# EAGLE design dev2 (EAGLE 5.10)
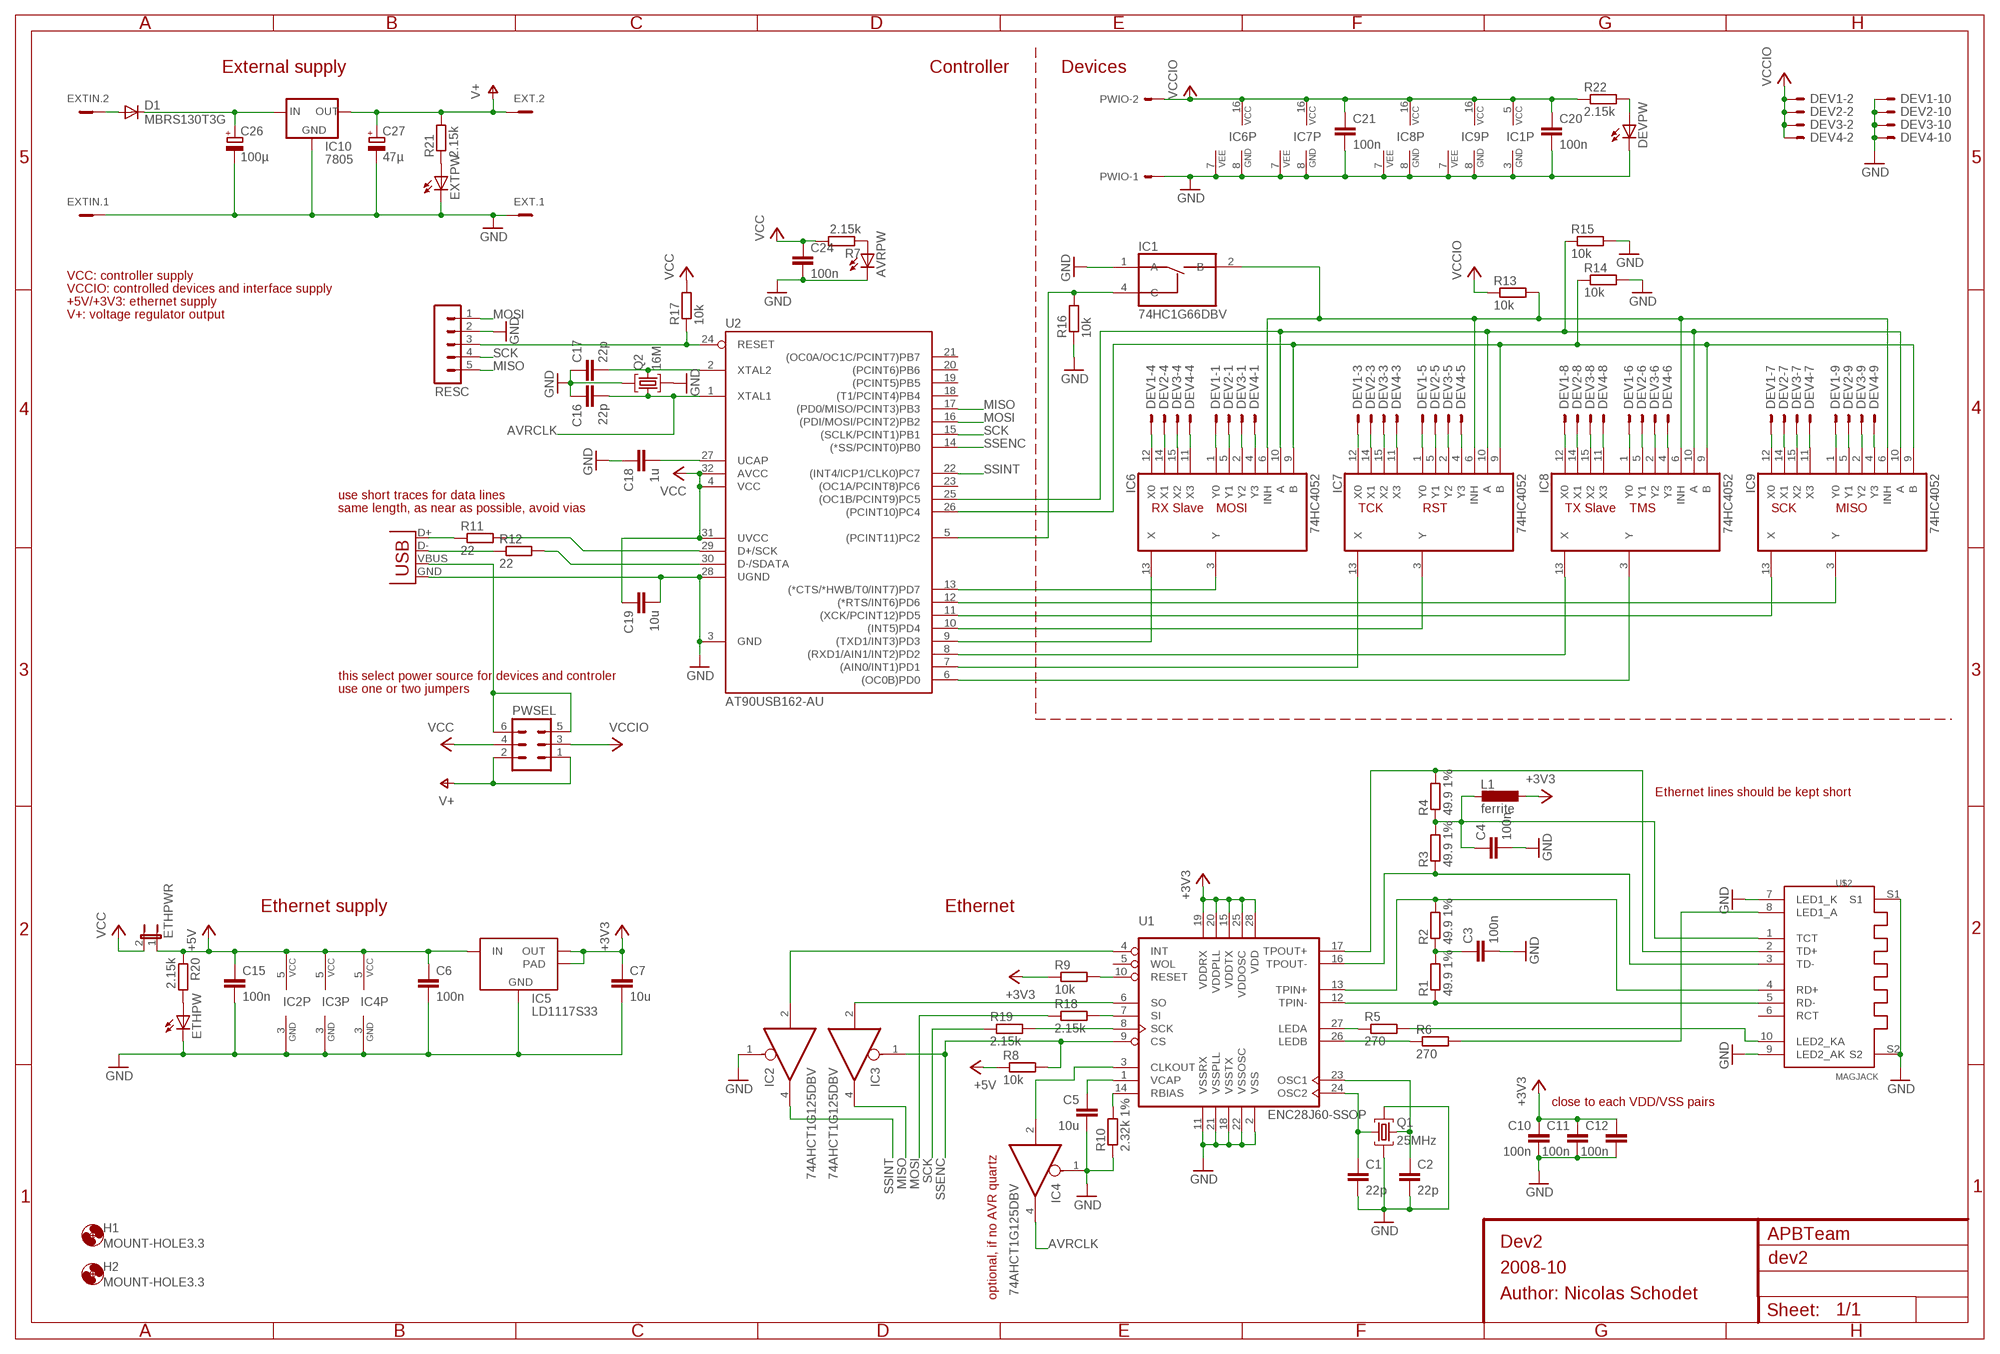
[diagram p0: schematic, sheet 1]

## Parts
AVRPW  LEDSMT1206  [1206]
C1  22p  C-EUC0603  [C0603]
C2  22p  C-EUC0603  [C0603]
C3  100n  C-EUC0603  [C0603]
C4  100n  C-EUC0603  [C0603]
C5  10u  C-EUC0603  [C0603]
C6  100n  C-EUC0603  [C0603]
C7  10u  C-EUC0603  [C0603]
C10  100n  C-EUC0603  [C0603]
C11  100n  C-EUC0603  [C0603]
C12  100n  C-EUC0603  [C0603]
C15  100n  C-EUC0603  [C0603]
C16  22p  C-EUC0603  [C0603]
C17  22p  C-EUC0603  [C0603]
C18  1u  C-EUC0603  [C0603]
C19  10u  C-EUC0603  [C0603]
C20  100n  C-EUC0603  [C0603]
C21  100n  C-EUC0603  [C0603]
C24  100n  C-EUC0603  [C0603]
C26  100µ  CPOL-EUD  [PANASONIC_D]
C27  47µ  CPOL-EUC  [PANASONIC_C]
D1  MBRS130T3G  DIODE-MELF-MLL41  [MELF-MLL41]
DEV1  ML10E  [ML10]
DEV2  ML10E  [ML10]
DEV3  ML10E  [ML10]
DEV4  ML10E  [ML10]
DEVPW  LEDSMT1206  [1206]
ETHPW  LEDSMT1206  [1206]
ETHPWR  JP1E  [JP1]
EXT  MC2  [MC2]
EXTIN  MC2  [MC2]
EXTPW  LEDSMT1206  [1206]
H1  MOUNT-HOLE3.3  [3,3]
H2  MOUNT-HOLE3.3  [3,3]
IC1  74HC1G66DBV  [SOT23-5]
IC2  74AHCT1G125DBV  [SOT23-5]
IC3  74AHCT1G125DBV  [SOT23-5]
IC4  74AHCT1G125DBV  [SOT23-5]
IC5  LD1117S33  1117-XX  [SOT223]
IC6  74HC4052  4052D  [SO16]
IC7  74HC4052  4052D  [SO16]
IC8  74HC4052  4052D  [SO16]
IC9  74HC4052  4052D  [SO16]
IC10  7805  78XXS  [78XXS]
L1  ferrite  L-EUL2012C  [L2012C]
PWIO  EC1X02  [EC1X02]
PWSEL  MA03-2  [MA03-2]
Q1  25MHz  Q2G  [ABMM1]
Q2  16M  Q2G  [ABMM1]
R1  49.9 1%  R-EU_R0603  [R0603]
R2  49.9 1%  R-EU_R0603  [R0603]
R3  49.9 1%  R-EU_R0603  [R0603]
R4  49.9 1%  R-EU_R0603  [R0603]
R5  270  R-EU_R0603  [R0603]
R6  270  R-EU_R0603  [R0603]
R7  2.15k  R-EU_R0603  [R0603]
R8  10k  R-EU_R0603  [R0603]
R9  10k  R-EU_R0603  [R0603]
R10  2.32k 1%  R-EU_R0603  [R0603]
R11  22  R-EU_R0603  [R0603]
R12  22  R-EU_R0603  [R0603]
R13  10k  R-EU_R0603  [R0603]
R14  10k  R-EU_R0603  [R0603]
R15  10k  R-EU_R0603  [R0603]
R16  10k  R-EU_R0603  [R0603]
R17  10k  R-EU_R0603  [R0603]
R18  2.15k  R-EU_R0603  [R0603]
R19  2.15k  R-EU_R0603  [R0603]
R20  2.15k  R-EU_R0603  [R0603]
R21  2.15k  R-EU_R0603  [R0603]
R22  2.15k  R-EU_R0603  [R0603]
RESC  MA05-1  [MA05-1]
U1  ENC28J60-SSOP  [SSOP28]
U2  AT90USB162-AU  [TQFP32-08]
U$2  MAGJACK  [08B0-1X1T-06-F]
USB  USB-B-H  [USB-B-H]

## Nets
+3V3: C7.1 C10.1 C11.1 C12.1 IC5.2(OUT) IC5.4(PAD) L1.1 R9.1 U1.15(VDDTX) U1.19(VDDRX) U1.20(VDDPLL) U1.25(VDDOSC) U1.28(VDD)
+5V: C6.1 C15.1 ETHPWR.1 IC2.5(VCC) IC3.5(VCC) IC4.5(VCC) IC5.3(IN) R8.1 R20.1
AVRCLK: C16.2 IC4.4(O) Q2.P$1 U2.1(XTAL1)
GND [supply]: AVRPW.C C1.2 C2.2 C3.2 C4.2 C5.2 C6.2 C7.2 C10.2 C11.2 C12.2 C15.2 C16.1 C17.1 C18.1 C19.2 C20.2 C21.2 C24.2 C26.- C27.- DEV1.10 DEV2.10 DEV3.10 DEV4.10 DEVPW.C ETHPW.C EXT.1 EXTIN.1 EXTPW.C IC1.1(A) IC1.3(GND) IC2.1(OE) IC2.3(GND) IC3.3(GND) IC4.1(OE) IC4.3(GND) IC5.1(GND) IC6.7(VEE) IC6.8(GND) IC7.7(VEE) IC7.8(GND) IC8.7(VEE) IC8.8(GND) IC9.7(VEE) IC9.8(GND) IC10.GND PWIO.1 Q1.P$2 Q1.P$4 Q2.P$2 Q2.P$4 R10.1 R14.2 R15.2 R16.1 RESC.2 U1.2(VSS) U1.11(VSSRX) U1.18(VSSTX) U1.21(VSSPLL) U1.22(VSSOSC) U2.3(GND) U2.28(UGND) U$2.7(LED1_K) U$2.9(LED2_AK) U$2.S1 U$2.S2 USB.GND
MISO: IC3.4(O) RESC.5 U2.17((PD0/MISO/PCINT3)PB3)
MOSI: R18.1 RESC.1 U2.16((PDI/MOSI/PCINT2)PB2)
MUXA: IC6.10(A) IC7.10(A) IC8.10(A) IC9.10(A) R15.1 U2.25((OC1B/PCINT9)PC5)
MUXB: IC6.9(B) IC7.9(B) IC8.9(B) IC9.9(B) R14.1 U2.26((PCINT10)PC4)
MUXEN: IC1.4(C) R16.2 U2.5((PCINT11)PC2)
MUXINH: IC1.2(B) IC6.6(INH) IC7.6(INH) IC8.6(INH) IC9.6(INH) R13.2
N$1: ETHPW.A R20.2
N$2: IC6.3(Y) U2.13((*CTS/*HWB/T0/INT7)PD7)
N$3: IC9.3(Y) U2.12((*RTS/INT6)PD6)
N$4: IC9.13(X) U2.11((XCK/PCINT12)PD5)
N$5: IC7.3(Y) U2.10((INT5)PD4)
N$6 [Ethernet]: C3.1 R1.2 R2.1
N$7: C1.1 Q1.P$1 U1.24(OSC2)
N$8: C2.1 Q1.P$3 U1.23(OSC1)
N$9: R5.2 U$2.10(LED2_KA)
N$10 [Ethernet]: R1.1 U1.12(TPIN-) U$2.5(RD-)
N$11 [Ethernet]: R2.2 U1.13(TPIN+) U$2.4(RD+)
N$12: R6.2 U$2.8(LED1_A)
N$13 [Ethernet]: C4.1 L1.2 R3.2 R4.1 U$2.1(TCT)
N$14: R5.1 U1.27(LEDA)
N$15 [Ethernet]: R3.1 U1.16(TPOUT-) U$2.3(TD-)
N$16 [Ethernet]: R4.2 U1.17(TPOUT+) U$2.2(TD+)
N$17: R6.1 U1.26(LEDB)
N$18: C5.1 U1.1(VCAP)
N$19: R9.2 U1.10(RESET)
N$20: R10.2 U1.14(RBIAS)
N$21: IC3.2(I) U1.6(SO)
N$22: IC2.2(I) U1.4(INT)
N$23: C17.2 Q2.P$3 U2.2(XTAL2)
N$24: D1.A EXTIN.2
N$25: IC4.2(I) U1.3(CLKOUT)
N$26: C26.+ D1.C IC10.IN
N$27: R12.2 U2.30(D-/SDATA)
N$28: R11.2 U2.29(D+/SCK)
N$30: R11.1 USB.D+
N$31: R12.1 USB.D-
N$32: R18.2 U1.7(SI)
N$33: IC6.13(X) U2.9((TXD1/INT3)PD3)
N$34: IC8.13(X) U2.8((RXD1/AIN1/INT2)PD2)
N$35: IC7.13(X) U2.7((AIN0/INT1)PD1)
N$36: IC8.3(Y) U2.6((OC0B)PD0)
N$37: DEV1.4 IC6.12(X0)
N$40: DEV2.4 IC6.14(X1)
N$41: DEV3.4 IC6.15(X2)
N$42: DEV4.4 IC6.11(X3)
N$43: DEV1.1 IC6.1(Y0)
N$44: DEV2.1 IC6.5(Y1)
N$45: DEV4.1 IC6.4(Y3)
N$46: DEV3.1 IC6.2(Y2)
N$47: DEV1.3 IC7.12(X0)
N$48: DEV2.3 IC7.14(X1)
N$49: DEV3.3 IC7.15(X2)
N$50: DEV4.3 IC7.11(X3)
N$51: DEV1.8 IC8.12(X0)
N$52: DEV1.5 IC7.1(Y0)
N$53: DEV2.5 IC7.5(Y1)
N$54: DEV3.5 IC7.2(Y2)
N$55: DEV4.5 IC7.4(Y3)
N$56: DEV2.8 IC8.14(X1)
N$57: DEV3.8 IC8.15(X2)
N$58: DEV4.8 IC8.11(X3)
N$59: DEV1.6 IC8.1(Y0)
N$60: DEV2.6 IC8.5(Y1)
N$61: DEV3.6 IC8.2(Y2)
N$62: DEV4.6 IC8.4(Y3)
N$63: DEV1.7 IC9.12(X0)
N$64: DEV2.7 IC9.14(X1)
N$65: DEV3.7 IC9.15(X2)
N$66: DEV4.7 IC9.11(X3)
N$67: DEV1.9 IC9.1(Y0)
N$68: DEV2.9 IC9.5(Y1)
N$69: DEV3.9 IC9.2(Y2)
N$70: DEV4.9 IC9.4(Y3)
N$75: EXTPW.A R21.1
N$76: R19.2 U1.8(SCK)
N$78: AVRPW.A R7.1
N$80: DEVPW.A R22.2
RESET: R17.1 RESC.3 U2.24(RESET)
SCK: R19.1 RESC.4 U2.15((SCLK/PCINT1)PB1)
SSENC: IC3.1(OE) R8.2 U1.9(CS) U2.14((*SS/PCINT0)PB0)
SSINT: IC2.4(O) U2.22((INT4/ICP1/CLK0)PC7)
UCAP: C18.2 U2.27(UCAP)
V+: C27.+ EXT.2 IC10.OUT PWSEL.1 PWSEL.2 R21.2
VBUS: PWSEL.5 PWSEL.6 USB.VBUS
VCC [supply]: C19.1 C24.1 ETHPWR.2 PWSEL.4 R7.2 R17.2 U2.4(VCC) U2.31(UVCC) U2.32(AVCC)
VCCIO [supply]: C20.1 C21.1 DEV1.2 DEV2.2 DEV3.2 DEV4.2 IC1.5(VCC) IC6.16(VCC) IC7.16(VCC) IC8.16(VCC) IC9.16(VCC) PWIO.2 PWSEL.3 R13.1 R22.1
Unconnected: U1.5(WOL) U2.18((T1/PCINT4)PB4) U2.19((PCINT5)PB5) U2.20((PCINT6)PB6) U2.21((OC0A/OC1C/PCINT7)PB7) U2.23((OC1A/PCINT8)PC6) U$2.6(RCT)

## Notes on the sheet
- External supply | Controller | Devices
- VCC: controller supply
- VCCIO: controlled devices and interface supply
- +5V/+3V3: ethernet supply
- V+: voltage regulator output
- use short traces for data lines
- same length, as near as possible, avoid vias | RX Slave | MOSI | TCK | RST | TX Slave | TMS | SCK | MISO
- this select power source for devices and controler
- use one or two jumpers
- Ethernet lines should be kept short
- Ethernet supply | Ethernet
- close to each VDD/VSS pairs
- APBTeam
- Dev2
- 2008-10
- optional, if no AVR quartz | Author: Nicolas Schodet

## Library data of the parts
AVRPW DEVPW ETHPW EXTPW = led:LED: LED OSRAM: - CHIPLED LG R971, LG N971, LY N971, LG Q971, LY Q971, LO R971, LY R971 LH N974, LH R974 LS Q976, LO Q976, LY Q976 LO Q996 - Hyper CHIPLED LW Q18S LB Q993, LB Q99A, LB R99A - SideLED LS A670, LO A670, LY A670, LG A670, LP A670 LB A673, LV A673, LT A673, LW A673 LH A674 LY A675 LS A676, LA A676, LO A676, LY A676, LW A676 LS A679, LY A679, LG A679 - Hyper Micro SIDELED® LS Y876, LA Y876, LO Y876, LY Y876 LT Y87S - SmartLED LW L88C, LW L88S LB L89C, LB L89S, LG L890 LS L89K, LO L89K, LY L89K LS L896, LA L896, LO L896, LY L896 - TOPLED LS T670, LO T670, LY T670, LG T670, LP T670 LSG T670, LSP T670, LSY T670, LOP T670, LYG T670 LG T671, LOG T671, LSG T671 LB T673, LV T673, LT T673, LW T673 LH T674 LS T676, LA T676, LO T676, LY T676, LB T676, LH T676, LSB T676, LW T676 LB T67C, LV T67C, LT T67C, LS T67K, LO T67K, LY T67K, LW E67C LS E67B, LA E67B, LO E67B, LY E67B, LB E67C, LV E67C, LT E67C LW T67C LS T679, LY T679, LG T679 LS T770, LO T770, LY T770, LG T770, LP T770 LB T773, LV T773, LT T773, LW T773 LH T774 LS E675, LA E675, LY E675, LS T675 LS T776, LA T776, LO T776, LY T776, LB T776 LHGB T686 LT T68C, LB T68C - Hyper Mini TOPLED® LB M676 - Mini TOPLED Santana® LG M470 LS M47K, LO M47K, LY M47K Source: http://www.osram.convergy.de/
C1-C7 C10-C12 C15-C21 C24 = rcl:C-EU: CAPACITOR, European symbol
C26 C27 = rcl:CPOL-EU: POLARIZED CAPACITOR, European symbol
D1 = diode:DIODE-: DIODE
DEV1-DEV4 = con-harting-ml:ML10?E: HARTING
ETHPWR = jumper:JP1E: JUMPER
EXT EXTIN = con-phoenix-381_l:MC2: Mini-Combicon 3.81mm horizontal 2-polig MC 1,5/2-G-3,81 Artikel-Nr. 1803277
H1 H2 = holes:MOUNT-HOLE: MOUNTING HOLE with drill center marker
IC1 = apbteam_logic:*1G66: Single bilateral ANALOG SWITCH
IC2-IC4 = 74xx-little-us:74*1G125: Single Bus Buffer Gate with 3-State Output
IC5 = apbteam_v-reg:1117-XX: Low-dropout voltage regulator
IC6-IC9 = 40xx:4052: Dual 4-channel ANALOG MULTIPLEXER
IC10 = v-reg:78XXS: VOLTAGE REGULATOR
L1 = rcl:L-EU: INDUCTOR, European symbol
PWIO = apbteam_con-amp-he14:E?1X02: Male header simple row, 2 positions
PWSEL = con-lstb:MA03-2: PIN HEADER
Q1 Q2 = apbteam_cristals:Q2G: Crystal with two ground connectors
R1-R22 = rcl:R-EU_: RESISTOR, European symbol
RESC = con-lstb:MA05-1: PIN HEADER
U1 = microchip-enc28j60:ENC28J60-*: Microchip 10Mbit Eth. contoller with SPI interface
U2 = at90usb:AT90USB162-*
U$2 = magjack:MAGJACK: Magjack RJ45: 08B0-1X1T-06-F mcgregor@blackmesaeast.com.pl
USB = con-usb:USB: USB Connectors

## Net classes
1 supply: width 0.254 mm
2 Ethernet: width 0.381 mm

## Board
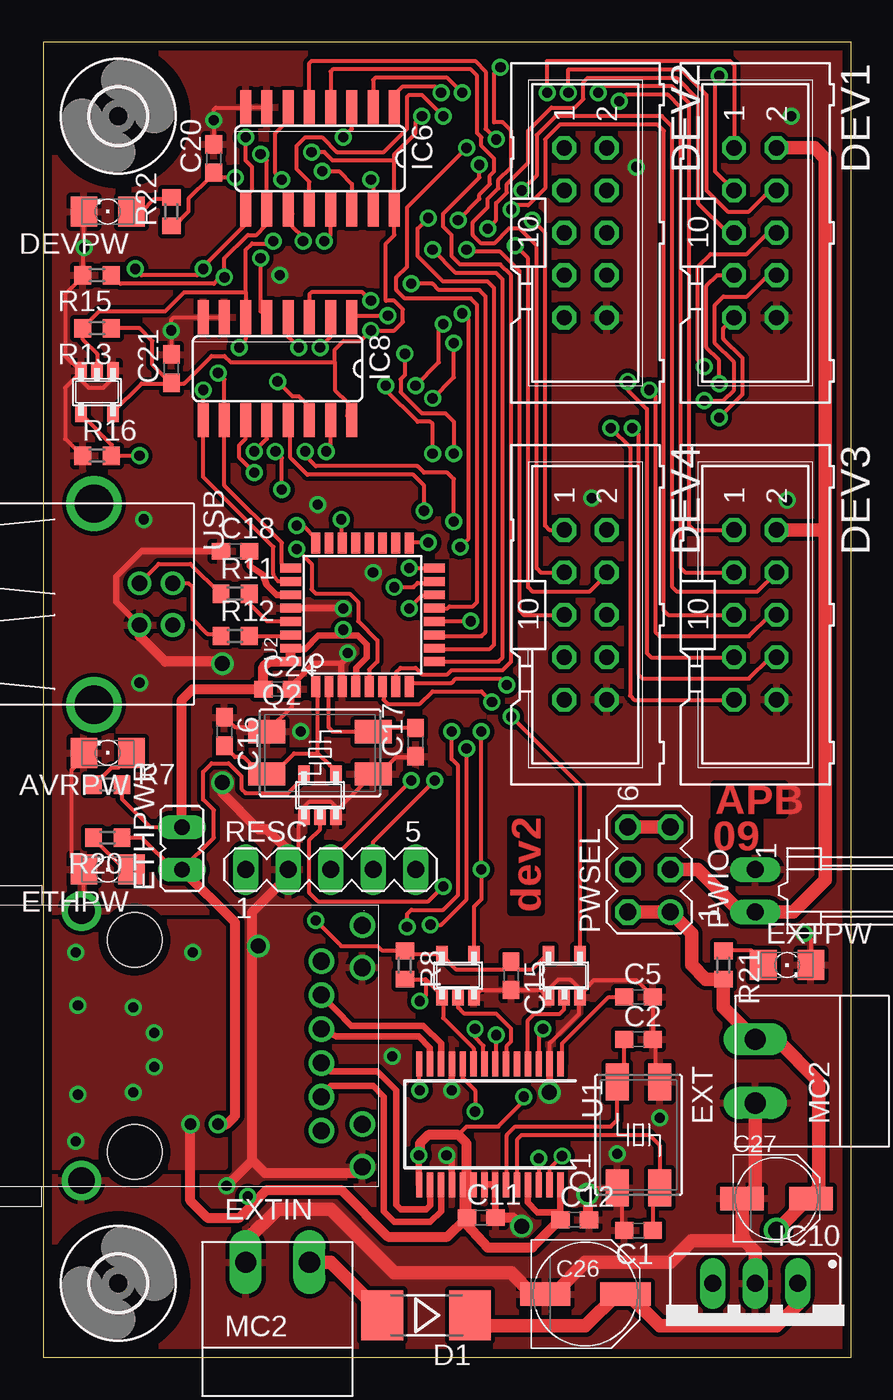
[diagram p1: board, top side]
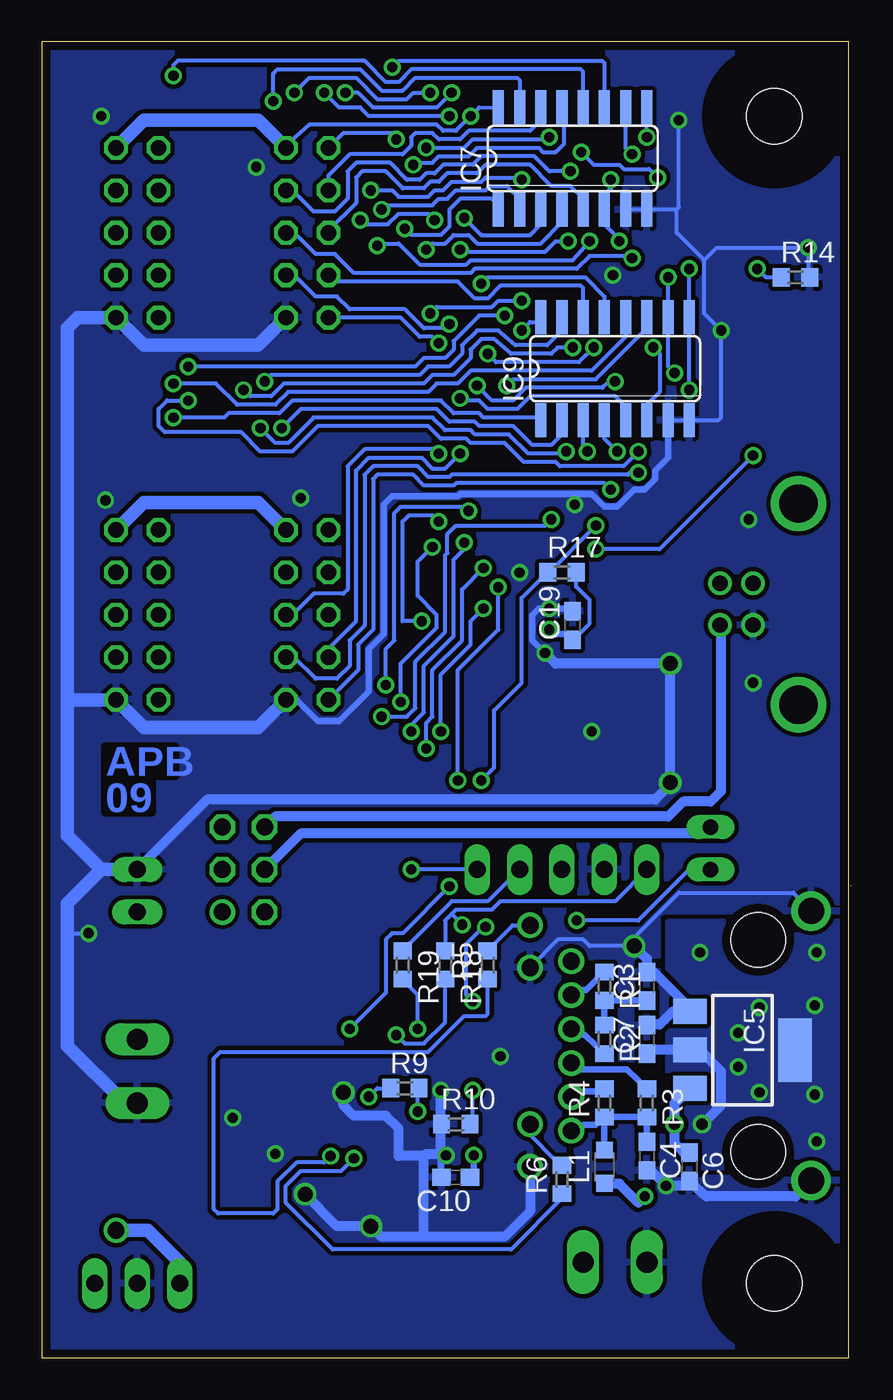
[diagram p2: board, bottom side, seen from below]

Size 48.26 x 78.74 mm. Coordinates in mm from the lower left corner, seen from the top.
Outline: 0,0 0,78.74 48.26,78.74 48.26,0 0,0
Copper layers (1*16): Top 0.035mm / dielectric 1.5mm / Bottom 0.035mm
Design rules "10mils": minimum track width 10mil, minimum drill 24mil, track to track 10mil, track to pad 10mil, pad to pad 10mil, via to via 10mil, smd to smd 10mil, copper to edge 20mil, drill to drill 10mil, minimum pad ring 10mil, minimum via ring 8mil, stop-mask expansion 0mil, vias tented up to drill 0mil, thermal gap 10mil
bKeepout: area 12.3,34.3 to 20.7,40.1; area 6.1,42.7 to 14.7,47.6

### Footprints (pad centres in the part's own frame; a part is rotated, then mirrored left to right if it is on the bottom)
1206 = smd 1.6 x 1.803: A -1.422,0; C 1.422,0
C0603 = smd 1.1 x 1: 1 -0.85,0; 2 0.85,0
PANASONIC_D = smd 3 x 1.4: + 2.4,0; - -2.4,0
PANASONIC_C = smd 2.6 x 1.4: + 2.05,0; - -2.05,0
MELF-MLL41 = smd 2.5 x 3: A 2.625,0; C -2.625,0
ML10 = drill 0.914 octagon: 1 -5.08,-1.27; 2 -5.08,1.27; 3 -2.54,-1.27; 4 -2.54,1.27; 5 0,-1.27; 6 0,1.27; 7 2.54,-1.27; 8 2.54,1.27; 9 5.08,-1.27; 10 5.08,1.27
JP1 = drill 0.914 long: 1 0,-1.27; 2 0,1.27
MC2 = drill 1.27 long: 1 -1.905,0; 2 1.905,0
3,3 = hole 3.3: 0,0
SOT23-5 = smd 0.69 x 0.99: 1 -0.95,-1.29; 2 0,-1.29; 3 0.95,-1.29; 4 0.95,1.3; 5 -0.95,1.3
SOT223 = smd 1.5 x 2: 1 -2.3,-3.15; 2 0,-3.15; 3 2.3,-3.15 | smd 3.8 x 2: 4 0,3.15
SO16 = smd 0.66 x 2.032: 1 -4.445,-3.073; 2 -3.175,-3.073; 3 -1.905,-3.073; 4 -0.635,-3.073; 5 0.635,-3.073; 6 1.905,-3.073; 7 3.175,-3.073; 8 4.445,-3.073; 9 4.445,3.073; 10 3.175,3.073; 11 1.905,3.073; 12 0.635,3.073; 13 -0.635,3.073; 14 -1.905,3.073; 15 -3.175,3.073; 16 -4.445,3.073
78XXS = drill 1.016 long: GND 0,-2.54; IN -2.54,-2.54; OUT 2.54,-2.54
L2012C = smd 1 x 1: 1 -1,0; 2 1,0
EC1X02 = drill 1 long: 1 -1.27,0; 2 1.27,0
MA03-2 = drill 1.016 round: 1 -2.54,-1.27 | drill 1.016 octagon: 2 -2.54,1.27; 3 0,-1.27; 4 0,1.27; 5 2.54,-1.27; 6 2.54,1.27
ABMM1 = smd 2.21 x 1.397: P$1 -3.175,-1.27; P$2 -3.175,1.27; P$3 3.175,1.27; P$4 3.175,-1.27
R0603 = smd 1 x 1.1: 1 -0.85,0; 2 0.85,0
MA05-1 = drill 1.016 long: 1 -5.08,0; 2 -2.54,0; 3 0,0; 4 2.54,0; 5 5.08,0
SSOP28 = smd 0.381 x 1.499: 1 -4.225,-3.625; 2 -3.575,-3.625; 3 -2.925,-3.625; 4 -2.275,-3.625; 5 -1.625,-3.625; 6 -0.975,-3.625; 7 -0.325,-3.625; 8 0.325,-3.625; 9 0.975,-3.625; 10 1.625,-3.625; 11 2.275,-3.625; 12 2.925,-3.625; 13 3.575,-3.625; 14 4.225,-3.625; 15 4.225,3.625; 16 3.575,3.625; 17 2.925,3.625; 18 2.275,3.625; 19 1.625,3.625; 20 0.975,3.625; 21 0.325,3.625; 22 -0.325,3.625; 23 -0.975,3.625; 24 -1.625,3.625; 25 -2.275,3.625; 26 -2.925,3.625; 27 -3.575,3.625; 28 -4.225,3.625
TQFP32-08 = smd 1.27 x 0.533: 1 -4.293,2.8; 2 -4.293,2; 3 -4.293,1.2; 4 -4.293,0.4; 5 -4.293,-0.4; 6 -4.293,-1.2; 7 -4.293,-2; 8 -4.293,-2.8; 17 4.293,-2.8; 18 4.293,-2; 19 4.293,-1.2; 20 4.293,-0.4; 21 4.293,0.4; 22 4.293,1.2; 23 4.293,2; 24 4.293,2.8 | smd 0.533 x 1.27: 9 -2.8,-4.293; 10 -2,-4.293; 11 -1.2,-4.293; 12 -0.4,-4.293; 13 0.4,-4.293; 14 1.2,-4.293; 15 2,-4.293; 16 2.8,-4.293; 25 2.8,4.293; 26 2,4.293; 27 1.2,4.293; 28 0.4,4.293; 29 -0.4,4.293; 30 -1.2,4.293; 31 -2,4.293; 32 -2.8,4.293
08B0-1X1T-06-F = drill 1.02 round: 1 2.15,2.46; 2 4.18,2.46; 3 6.21,2.46; 4 8.24,2.46; 5 10.27,2.46; 6 12.3,2.46; 7 0,0; 8 2.54,0; 9 11.91,0; 10 14.45,0 | drill 1.57 round: S1 -0.83,16.808; S2 15.3,16.809 | hole 3.25: 0.88,13.63; 13.58,13.63
USB-B-H = drill 0.914 round: D+ 0,1.25; D- 1.981,1.25; GND 0,-1.25; VBUS 1.981,-1.25 | drill 2.286 round: P$1 -2.718,-6.02; P$2 -2.718,6.02

### Placement (x,y rotation side)
AVRPW  3.81,36.2 180 top
C1  35.56,7.62 180 top
C2  35.56,19.05 0 top
C3  12.06,22.23 90 bottom
C4  12.06,12.06 270 bottom
C5  35.56,21.59 0 top
C6  9.53,11.43 270 bottom
C7  12.06,19.05 90 bottom
C10  23.5,10.79 180 bottom
C11  26.16,8.38 0 top
C12  31.75,8.26 0 top
C15  27.94,22.86 270 top
C16  10.79,37.47 270 top
C17  22.23,36.83 90 top
C18  11.43,48.26 0 top
C19  16.51,43.81 90 bottom
C20  10.16,71.75 90 top
C21  7.62,59.18 90 top
C24  13.97,40.01 0 top
C26  32.38,3.81 0 top
C27  43.81,9.53 0 top
D1  22.86,2.54 180 top
DEV1  42.55,67.31 270 top
DEV2  32.38,67.31 270 top
DEV3  42.55,44.45 270 top
DEV4  32.38,44.45 270 top
DEVPW  3.81,68.58 180 top
ETHPW  3.81,29.21 180 top
ETHPWR  8.26,30.48 0 top
EXT  42.55,17.14 90 top
EXTIN  13.97,5.71 0 top
EXTPW  44.45,23.5 0 top
H1  4.45,74.3 0 top
H2  4.45,4.45 0 top
IC1  3.17,57.78 180 top
IC2  31.11,22.86 0 top
IC3  24.77,22.86 0 top
IC4  16.51,33.66 0 top
IC5  6.35,18.41 270 bottom
IC6  16.51,71.75 180 top
IC7  16.51,71.75 0 bottom
IC8  13.97,59.18 180 top
IC9  13.97,59.18 0 bottom
IC10  42.55,1.91 180 top
L1  14.61,11.43 90 bottom
PWIO  42.55,27.94 270 top
PWSEL  36.2,29.21 90 top
Q1  35.56,13.34 90 top
Q2  16.51,36.2 0 top
R1  14.61,22.23 270 bottom
R2  14.61,19.05 270 bottom
R3  12.06,15.24 270 bottom
R4  14.61,15.24 90 bottom
R5  21.59,23.5 90 bottom
R6  17.14,10.67 90 bottom
R7  3.81,34.29 0 top
R8  21.59,23.5 270 top
R9  26.54,16.13 0 bottom
R10  23.5,13.97 0 bottom
R11  11.43,45.72 0 top
R12  11.43,43.18 0 top
R13  3.17,61.59 180 top
R14  3.17,64.64 0 bottom
R15  3.17,64.77 180 top
R16  3.17,53.98 0 top
R17  17.14,46.99 0 bottom
R18  24.13,23.5 270 bottom
R19  26.67,23.5 270 bottom
R20  3.81,31.11 180 top
R21  40.64,23.5 270 top
R22  7.62,68.58 90 top
RESC  17.14,29.21 0 top
U1  26.67,13.97 180 top
U2  19.05,44.45 90 top
U$2  19.05,11.43 90 top
USB  5.71,45.09 0 top

### Tracks (layer width: path | path; a pad name or v marks a point on that pad's centre or on a via)
+3V3  (via drill 0.61, 0.7)
  Top 0.254: v28.7,15.62 28.7,15.37 27.18,13.84 25.27,13.84 24.77,13.34
  Top 0.381: U1.28 30.89,10.34 30.89,8.27 C12.1 30.86,8.29 30.86,8.71 29.52,8.71 28.93,9.3 28.93,10.33 U1.25 | 25.04,10.36 U1.19 25.05,10.34 | 25.04,8.65 C11.1 25.15,8.38 25.05,8.48 25.05,10.34 | 25.69,10.34 U1.20 25.59,10.35 25.53,10.29 25.48,10.34 25.05,10.34 | U1.15 22.43,10.36 v22.43,12.12 22.43,12.14 22.48,12.19
  Top 0.61: v8.76,13.97 8.76,9.4 9.78,8.38 11.68,8.38 12.57,9.27 | 25.27,8.38 C11.1 25.31,7.96 26.54,6.6 29.21,6.6 30.86,8.26 C12.1 | 25.27,8.38 24.13,7.24 20.57,7.24 17.78,10.03 13.34,10.03 12.57,9.27 | 25.27,8.38 25.27,12.83 24.77,13.34 22.99,13.34 22.48,12.83 22.48,12.19 22.48,12.06 | 12.57,9.27 v12.19,9.65
  Bottom 0.254: v28.7,15.62 28.19,16.13 R9.1
  Bottom 0.381: C10.1 22.43,11.01 v22.43,12.12
  Bottom 0.61: v8.76,13.97 7.62,15.11 7.62,17.14 8.89,18.41 IC5.2 11.68,18.41 11.94,18.16 11.98,18.2 C7.1 | v12.19,9.65 12.57,9.27 13.72,10.41 14.61,10.41 L1.1
  other vias: 1.91,24.26 2.03,21.08 8.89,24.26 2.03,15.75 1.91,12.95 5.33,20.95 6.6,19.43 6.6,17.4 5.33,15.88
  pour Bottom (isolate 0.254, no thermals): 0,26.04 10.79,26.04 10.79,11.43 0,11.43
  pour Top (isolate 0.254, no thermals): 0,26.04 10.79,26.04 10.79,11.43 0,11.43
+5V  (via drill 0.61, 0.7)
  Top 0.254: IC4.5 15.56,34.74 14.61,33.78 12.06,33.78 11.81,34.04 11.81,34.8 11.05,35.56 10.03,35.56 9.53,35.05 9.53,33.4 10.16,32.77 10.16,31.11 ETHPWR.1 7.75,29.21 5.84,31.11 R20.1 | 21.59,24.38 R8.1 | 21.59,24.38 21.81,24.16 IC3.5 23.82,24.06 24.64,23.24 27.56,23.24 27.94,23.62 | IC2.5 30.13,24.16 29.21,23.24 28.32,23.24 27.94,23.62 | 27.94,23.62 C15.1 | 21.59,24.38 20.19,24.38 19.94,24.64 17.78,24.64 v16.26,26.16
  Top 0.61: ETHPWR.1 11.43,26.04 11.43,14.48 10.92,13.97 v10.41,13.97
  Bottom 0.254: v16.26,26.16 12.57,26.16 9.53,29.21 ETHPWR.1
  Bottom 0.61: IC5.3 9.5,16.03 9.53,16 10.41,15.24 v10.41,13.97 10.41,12.83 9.87,12.28 C6.1
AVRCLK
  Top 0.254: 16.38,36.17 16.38,39.55 U2.1 | 16.38,36.17 17.12,35.43 IC4.4 | 16.38,36.17 14.96,36.17 13.84,35.05 13.59,35.05 13.46,34.92 Q2.P$1 12.95,34.92 11.94,35.94 11.43,35.94 C16.2
GND  (via drill 0.61, 0.9)
  Top 0.254: C1.2 34.54,7.62 34.54,10.16 Q1.P$2 32.89,10.16 v32.51,9.78 | Q1.P$4 36.58,16.51 36.58,18.92 36.45,19.05 C2.2 36.41,21.55 36.45,21.59 C5.2 36.41,21.63 35.43,22.61 32.89,22.61 32.06,21.65 | 45.85,23.5 EXTPW.C 45.87,25.04 v45.47,25.4 | 12.06,74.8 IC6.8 | IC6.7 12.09,74.83 12.06,74.8 | 12.06,74.8 10.29,74.8 10.16,74.68 v10.16,74.04 C20.2 | IC8.7 9.55,62.26 9.53,62.23 IC8.8 7.77,62.26 7.62,62.1 v7.62,61.47 C21.2 7.62,59.94 | 2.39,64.87 2.29,64.77 R15.2 2.33,64.68 | 2.33,64.68 1.27,63.63 1.27,59.94 2.16,59.05 2.18,59.08 IC1.3 | IC1.3 2.23,58.48 2.67,58.04 3.56,58.04 4.06,58.55 4.06,59.05 4.08,59.08 IC1.1 | IC1.3 2.23,58.99 1.27,58.04 1.27,54.99 2.29,53.98 R16.1 | C24.2 14.82,38.95 Q2.P$2 13.08,37.72 11.43,37.72 C16.1 | C17.1 22.14,35.98 22.1,35.94 21.08,35.94 20.07,34.92 Q2.P$4 17.46,32.7 IC4.3 17.42,32.37 17.4,32.38 17.4,33.02 17.14,33.27 15.88,33.27 15.56,32.96 IC4.1 15.24,31.88 15.24,30.35 RESC.2 | 32.06,21.65 32.06,22.04 31.5,22.61 30.73,22.61 30.16,22.04 IC2.1 30.12,21.57 29.72,21.97 27.94,21.97 | 32.06,21.65 IC2.3 32.02,21.57 32,21.59 32,20.57 30.25,18.82 U1.2 | 27.94,21.97 C15.2 | IC3.3 26.12,21.97 27.94,21.97 | AVRPW.C 2.39,35.92 1.65,35.18 1.65,29.97 2.41,29.21 ETHPW.C 2.39,26.9 2.24,26.75 U$2.S2 | DEVPW.C 2.39,66.45 v2.41,66.42 2.33,66.33 2.33,64.68
  Top 0.305: C24.2 14.82,40.22 16.13,41.53 17.78,41.53 | 17.85,40.19 U2.3
  Top 0.381: U1.18 24.39,11.8 v24.08,12.12 | C11.2 27,8.39 U1.22 26.98,10.36 26.34,10.36 U1.21 | U1.11 24.38,17.58 v24.38,16 | U1.2 30.25,15.89 v30.23,15.88 | 17.85,40.19 17.78,40.26 17.78,41.53 18.16,41.91 v18.16,42.16 | U2.28 17.93,44.85 v17.91,44.83 | C18.1 5.84,48.26 4.32,46.74 4.32,45.21 5.71,43.81
  Top 0.61: C11.2 28.07,8.38 v28.57,7.87 | C12.2 32.51,8.26 v32.51,9.78 | USB.GND 5.71,43.81 5.71,43.18 7.24,41.66 10.54,41.66 v10.67,41.53 | 12.45,11.81 12.45,24.64 | 12.45,11.81 13.21,11.05 18.67,11.05 U$2.7 | v10.67,34.42 10.67,33.78 12.83,31.62 13.34,31.62 14.61,30.35 RESC.2 14.61,28.83 12.45,26.67 12.45,24.64 | 12.45,24.64 v12.83,24.64 | v10.92,10.29 12.45,11.81
  Top 0.813: EXTIN.1 12.06,6.99 13.97,8.89 17.14,8.89 20.95,5.08 27.94,5.08 29.21,3.81 C26.- 30.48,3.81 32.38,5.71 37.47,5.71 38.73,6.99 41.91,6.99 | 41.91,6.99 42.55,6.35 IC10.GND | 41.91,6.99 41.77,7.47 C27.- 41.91,9.53 42.55,10.16 EXT.1
  Bottom 0.254: 10.29,68.71 10.16,68.83 v10.16,74.04 | 10.29,68.71 12.06,68.71 IC7.8 13.31,68.68 13.34,68.71 IC7.7 | IC9.7 9.55,56.11 9.53,56.13 IC9.8 7.77,56.11 7.62,56.26 v7.62,61.47 8.64,62.48 8.64,65.66 | 10.29,68.71 10.29,67.31 8.64,65.66 | R14.2 2.29,64.64 2.41,64.77 v2.41,66.42 7.87,66.42 8.64,65.66 | U$2.9 19.05,23.37 17.4,25.02 15.88,25.02 15.49,24.64 v12.83,24.64 12.83,25.15 10.16,27.81 3.3,27.81 2.24,26.75 U$2.S2 | 46.74,25.4 v45.47,25.4
  Bottom 0.381: 24.38,10.76 24.38,10.74 | 24.38,10.76 C10.2 | 24.13,12.06 24.38,11.81 24.38,10.76 | 24.38,12.42 v24.08,12.12 24.13,12.06 | 24.38,13.93 R10.1 | 24,12.19 24.13,12.06 | DEV4.10 33.02,39.37 31.75,38.1 30.48,38.1 28.7,39.88 28.7,42.42 27.81,43.31 27.81,51.05 27.3,51.56 23.37,51.56 23.24,51.69 15.37,51.69 14.61,50.93 13.84,50.93 12.83,51.94 12.19,51.94 11.56,52.58 11.56,53.09 10.79,53.85 IC9.7 10.79,56.13 | C19.2 16.51,44.83 v17.91,44.83 18.54,44.83 18.92,44.45 18.92,42.93 v18.16,42.16
  Bottom 0.61: 24.38,12.42 24.38,13.93 | v24.38,16 24.38,14.01 R10.1 24.38,13.97 | v32.51,9.78 30.61,7.87 v28.57,7.87 27.94,7.24 25.4,7.24 | U$2.7 19.05,8.76 20.57,7.24 25.4,7.24 | 24,12.19 25.27,12.19 25.4,12.06 | 25.4,7.24 25.4,12.06 | v30.23,15.88 30.23,15.11 29.59,14.48 27.69,14.48 26.92,13.72 26.92,12.06 25.4,12.06 | PWIO.1 38.35,33.4 11.56,33.4 10.67,34.29 v10.67,34.42 v10.67,41.53 17.53,41.53 v18.16,42.16 | C19.2 16.51,44.7 | v12.83,24.64 12.06,23.88 C3.2 11.64,23.07 9.5,20.93 IC5.1 10.53,20.71 11.3,19.94 11.94,19.94 11.98,19.9 C7.2 | 9.53,10.54 9.78,10.29 v10.92,10.29 11.81,11.18 C4.2 | 9.53,10.54 C6.2 | 9.53,10.54 8.51,9.65 3.17,9.65 2.16,10.67 2.22,10.6 U$2.S1
  Bottom 0.813: PWIO.1 44.7,29.21 | 44.7,29.21 46.74,31.24 46.74,39.37 | 46.74,39.37 46.74,61.59 46.1,62.23 DEV1.10 42.16,60.58 35.31,60.58 DEV2.10 | 46.74,39.37 DEV3.10 42.16,37.72 35.31,37.72 DEV4.10 | EXT.1 43.31,15.24 46.74,18.67 46.74,25.4 46.74,27.18 44.7,29.21
  other vias: 16.38,51.05 15.37,37.47 36.83,14.35 34.29,12.19 35.43,71.25 44.7,74.3 44.45,51.31 32.77,51.44 5.97,50.16 5.71,40.39 14.1,64.77 19.68,46.99 20.83,18.03
  pour Bottom (isolate 0.254, rank 2): 0,78.74 48.26,78.74 48.26,0 0,0
  pour Top (isolate 0.254, rank 2): 0,78.74 48.26,78.74 48.26,0 0,0
MISO  (via drill 0.61)
  Top 0.254: IC3.4 25.71,26.98 26.16,27.43 v26.16,29.21 v26.16,37.47 | U2.17 21.85,48.76 21.84,48.77 v22.99,48.77
  Bottom 0.254: v26.16,37.47 26.16,37.85 25.4,38.61 25.4,41.4 23.62,43.18 23.62,47.75 22.99,48.39 v22.99,48.77 | RESC.5 v26.16,29.21 RESC.5
MOSI  (via drill 0.61)
  Top 0.254: v23.11,25.91 23.75,25.91 25.27,27.43 v25.27,36.45 | U2.16 23.36,47.25 23.37,47.24 v21.84,47.24
  Bottom 0.254: RESC.1 13.97,27.3 20.83,27.3 21.34,26.8 23.5,26.8 23.75,26.54 | R18.1 24.13,26.16 23.75,26.54 | 23.75,26.54 v23.11,25.91 | v25.27,36.45 25.27,37.97 24.89,38.35 24.89,41.15 23.11,42.93 23.11,45.97 v21.84,47.24
MUXA  (via drill 0.61)
  Top 0.254: v12.95,72.01 13.34,71.63 IC6.10 13.34,67.82 12.7,67.18 12.19,67.18 10.79,65.79 v10.79,64.64 10.54,64.64 10.16,64.26 4.57,64.26 4.06,64.77 R15.1 | v10.41,58.93 10.79,58.55 IC8.10 10.79,52.2 14.22,48.77 14.22,47.5 14.47,47.25 U2.25
  Bottom 0.254: v12.95,72.01 13.34,72.39 IC7.10 | IC9.10 10.79,62.23 | IC9.10 v10.79,64.64 | v10.41,58.93 10.79,59.31 IC9.10
MUXB  (via drill 0.61)
  Top 0.254: v12.06,73.03 12.06,71.63 12.45,71.25 12.45,69.85 12.06,69.47 IC6.9 12.06,67.82 9.53,65.28 v9.53,65.15 9.14,64.77 5.84,64.77 v5.46,65.15 | v9.53,57.91 IC8.9 9.53,52.7 13.72,48.51 13.72,46.86 14,46.45 U2.26
  Bottom 0.254: v12.06,73.03 IC7.9 | IC9.9 9.53,62.23 | IC9.9 v9.53,65.15 | v9.53,57.91 IC9.9 | v5.46,65.15 4.95,64.64 R14.1
MUXEN  (via drill 0.61)
  Top 0.254: IC1.4 2.32,56.36 4.06,54.61 4.06,53.98 | U2.5 19.45,41.17 19.94,41.66 19.94,42.93 18.8,44.07 18.8,45.21 18.29,45.72 16.26,45.72 16,45.97 16,47.5 v15.11,48.39 | R16.2 4.06,53.98 | 4.06,53.98 v5.71,53.98
  Bottom 0.254: v15.11,48.39 11.3,48.39 v5.71,53.98
MUXINH  (via drill 0.61)
  Top 0.254: v14.22,70.48 13.84,70.87 13.84,73.28 14.61,74.04 IC6.6 | v13.72,66.8 13.59,66.67 12.45,66.67 12.06,66.29 12.06,63.75 | IC8.6 12.06,62.23 | 12.06,63.75 IC8.6 | v11.68,60.45 12.06,60.96 IC8.6 | 12.06,63.75 8.38,63.75 7.24,62.61 3.3,62.61 R13.2 2.33,60.92 3.17,60.07 IC1.2 3.17,59.05
  Bottom 0.254: v14.22,70.48 14.22,69.98 14.61,69.6 IC7.6 14.61,67.82 13.72,66.93 v13.72,66.8 | IC9.6 12.06,57.02 11.3,57.78 11.3,60.07 v11.68,60.45
N$1
  Top 0.254: R20.2 2.96,31.08 4.83,29.21 ETHPW.A
N$2  (via drill 0.61)
  Top 0.254: v17.91,73.03 18.41,73.53 IC6.3 | v25.27,72.39 21.72,68.83 21.72,65.28 21.08,64.64 21.08,63.88 21.59,63.37 25.53,63.37 25.91,62.99 25.91,45.21 25.65,44.96 24.26,44.96 24.13,44.83 23.37,44.83 U2.13
  Bottom 0.254: v17.91,73.03 18.03,72.9 22.48,72.9 22.99,72.39 v25.27,72.39
N$3  (via drill 0.61)
  Top 0.254: v15.62,54.23 15.62,53.98 16.26,53.34 22.35,53.34 22.73,52.96 24.13,52.96 24.51,52.58 v24.51,50.04 | U2.12 23.37,44.07 v25.53,44.07
  Bottom 0.254: IC9.3 15.88,54.48 v15.62,54.23 | v25.53,44.07 26.67,44.07 26.67,50.04 26.29,50.42 24.89,50.42 v24.51,50.04
N$4  (via drill 0.61)
  Top 0.254: v21.97,64.26 23.24,64.26 23.62,63.88 26.04,63.88 26.42,63.5 26.42,43.43 26.16,43.18 23.37,43.18 23.34,43.2 U2.11
  Bottom 0.254: IC9.13 14.61,63.5 15.75,64.64 21.59,64.64 v21.97,64.26
N$5  (via drill 0.61)
  Top 0.254: 23.4,42.45 U2.10 23.37,42.42 26.67,42.42 26.92,42.67 26.92,64.01 26.54,64.39 23.88,64.39 22.35,65.91 22.35,67.56 v22.99,68.2
  Bottom 0.254: IC7.3 18.41,67.82 19.05,67.18 21.97,67.18 v22.99,68.2
N$6
  Bottom 0.381: R2.1 R1.2 14.07,21.39 12.55,21.39 C3.1
N$7
  Top 0.254: U1.24 28.3,10.39 28.32,10.41 28.32,13.08 28.57,13.34 36.2,13.34 36.83,12.7 Q1.P$1 36.42,9.07 36.42,8.1 C1.1
N$8
  Top 0.254: U1.23 27.64,10.37 27.69,10.41 27.69,13.34 28.19,13.84 33.91,13.84 34.29,14.22 Q1.P$3 34.72,17.6 34.72,18.57 C2.1
N$9
  Bottom 0.254: R5.2 21.59,24.38 20.09,25.88 U$2.10
N$10
  Top 0.381: U1.12 23.75,18.34 23.75,18.8 22.68,19.86 18.36,19.86 U$2.5
  Bottom 0.381: R1.1 15.14,22.58 15.7,22.02 15.85,22.02 U$2.5
N$11
  Top 0.381: U1.13 23.09,18.34 23.09,18.54 22.4,19.23 17.48,19.23 U$2.4
  Bottom 0.381: R2.2 15.14,18.69 15.77,19.33 15.85,19.33 U$2.4
N$12
  Bottom 0.254: R6.2 17.65,11.94 18.92,13.21 U$2.8
N$13
  Bottom 0.381: R4.1 15.14,13.92 15.85,13.92 U$2.1 | R4.1 14.07,14.4 12.6,14.4 R3.2 C4.1 | R4.1 L1.2
N$14  (via drill 0.61)
  Top 0.254: U1.27 30.25,11.32 v30.99,12.06
  Bottom 0.254: v30.99,12.06 31.37,11.68 33.02,11.68 34.16,10.54 34.16,8.89 34.42,8.64 37.72,8.64 37.97,8.89 37.97,17.91 37.59,18.29 25.15,18.29 22.99,20.45 21.72,20.45 21.59,20.57 R5.1
N$15
  Top 0.381: U1.16 23.09,9.12 22.86,8.89 21.34,8.89 21.08,9.14 21.08,16 19.94,17.14 17.14,17.14 16.64,17.65 16.62,17.64 U$2.3
  Bottom 0.381: R3.1 12.6,16.59 13.26,17.25 15.93,17.25 U$2.3
N$16
  Top 0.381: U$2.2 16.5,15.61 17.14,16.26 19.68,16.26 20.32,15.62 20.32,8.76 20.95,8.13 23.11,8.13 23.75,8.76 23.75,10.41 U1.17
  Bottom 0.381: R4.2 15.14,15.95 15.85,15.95 U$2.2
N$17  (via drill 0.61)
  Top 0.254: v29.59,11.94 29.59,11.05 U1.26
  Bottom 0.254: R6.1 17.14,9.53 20.19,6.48 30.86,6.48 33.66,9.27 33.66,10.29 32.77,11.18 30.35,11.18 v29.59,11.94
N$18
  Top 0.254: C5.1 33.78,21.59 30.99,18.8 30.99,17.65 30.93,17.59 U1.1
N$19  (via drill 0.61)
  Top 0.254: U1.10 25.05,16.74 25.78,16 v25.78,14.73
  Bottom 0.254: R9.2 25.78,16 v25.78,14.73
N$20  (via drill 0.61)
  Top 0.254: U1.14 22.45,16.04 v22.48,16
  Bottom 0.254: v22.48,16 22.48,14.1 22.61,13.97
  Bottom 0.381: R10.2 22.61,13.97
N$21
  Top 0.254: IC3.2 24.77,20.95 25.15,20.57 27.05,20.57 27.94,19.68 27.94,18.92 27.69,18.67 27.69,17.65 27.64,17.61 U1.6
N$22
  Top 0.254: U1.4 28.95,20.18 29.34,20.57 30.86,20.57 31.11,20.83 IC2.2 31.11,21.59
N$23
  Top 0.254: U2.2 17.05,40.04 17.02,39.88 17.02,37.72 17.27,37.47 Q2.P$3 19.68,37.59 19.81,37.72 22.23,37.72 C17.2
N$24
  Top 0.813: D1.A 20.32,2.54 17.14,5.71 EXTIN.2
N$25  (via drill 0.61)
  Top 0.254: U1.3 29.59,19.43 v29.84,19.68 | IC4.2 16.51,31.62 15.88,30.99 15.88,27.81 16.38,27.3 22.99,27.3 v23.88,28.19
  Bottom 0.254: v29.84,19.68 27.69,21.84 27.69,25.02 27.3,25.4 26.67,25.4 v23.88,28.19
N$26
  Top 0.813: D1.C 25.48,2.46 26.04,1.91 32.38,1.91 34.29,3.81 C26.+ 34.92,3.81 36.83,1.91 43.81,1.91 45.09,3.17 IC10.IN
N$27
  Top 0.254: U2.30 14.79,43.25 14.86,43.18 R12.2
N$28
  Top 0.254: R11.2 12.28,45.12 13.34,44.07 14.73,44.07 U2.29
N$30
  Top 0.254: USB.D+ 5.71,46.35 6.86,47.5 8.76,47.5 10.54,45.72 R11.1
N$31
  Top 0.254: USB.D- 8.66,46.34 8.89,46.1 8.89,44.2 9.78,43.31 10.41,43.31 10.54,43.18 R12.1
N$32  (via drill 0.61)
  Top 0.254: U1.7 27,17.71 27.05,18.41 v27.05,19.3
  Bottom 0.254: v27.05,19.3 26.54,18.8 25.4,18.8 24.13,20.07 R18.2
N$33  (via drill 0.61)
  Top 0.254: IC6.13 17.14,67.18 v16.76,66.8 | v23.24,66.29 24.64,64.9 27.05,64.9 27.43,64.52 27.43,41.91 27.18,41.66 23.37,41.66 | 23.37,41.66 23.37,41.65 | 23.37,41.66 23.36,41.65 U2.9
  Bottom 0.254: v16.76,66.8 17.53,66.8 18.16,66.17 23.11,66.17 v23.24,66.29
N$34  (via drill 0.61)
  Top 0.254: IC8.13 14.61,55.37 14.73,55.24 14.73,53.85 15.75,52.83 22.1,52.83 22.73,52.2 v22.73,50.67 | U2.8 21.87,40.16 22.1,40.39 24.38,40.39 24.64,40.64 27.3,40.64 v27.69,40.26
  Bottom 0.254: v27.69,40.26 27.69,42.42 27.18,42.93 27.18,50.55 26.8,50.93 22.99,50.93 v22.73,50.67
N$35  (via drill 0.61)
  Top 0.254: v26.04,71.37 26.04,70.61 23.88,68.45 23.88,67.69 24.38,67.18 24.38,65.91 24.89,65.41 27.3,65.41 27.94,64.77 27.94,41.66 27.43,41.15 24.38,41.15 24.13,40.89 22.61,40.89 22.23,41.27 21.34,41.27 21.08,41.02 21.08,40.26 21.05,40.23 U2.7
  Bottom 0.254: IC7.13 17.02,74.68 17.02,72.64 17.53,72.14 18.29,72.14 18.54,72.39 22.23,72.39 22.73,71.88 24.51,71.88 24.89,71.5 25.91,71.5 v26.04,71.37
N$36  (via drill 0.61)
  Top 0.254: IC8.3 15.88,63.63 16,63.75 19.05,63.75 v19.56,63.25 | v25.02,62.48 25.4,62.1 25.4,49.02 v24.89,48.51 | v26.8,39.24 26.16,39.88 23.24,39.88 22.48,39.12 20.57,39.12 20.32,39.37 20.32,40.13 20.3,40.16 U2.6
  Bottom 0.254: v19.56,63.25 20.95,63.25 21.34,62.87 24.64,62.87 v25.02,62.48 | v24.89,48.51 25.78,47.62 25.78,45.59 24.64,44.45 24.64,43.69 26.8,41.53 v26.8,39.24
N$37  (via drill 0.61)
  Top 0.254: DEV1.4 43.43,69.85 42.16,68.58 40.89,68.58 39.62,69.85 39.62,75.56 38.1,77.09 31.37,77.09 v31.37,75.69 | IC6.12 15.88,70.36 15.11,71.12 15.11,72.52 15.62,73.03 16.64,73.03 17.53,72.14 20.32,72.14 21.72,73.53 21.72,75.44 21.84,75.56 22.61,75.56 v23.88,74.3
  Bottom 0.254: v23.88,74.3 28.7,74.3 29.21,74.8 30.48,74.8 v31.37,75.69
N$40  (via drill 0.61)
  Top 0.254: IC6.14 18.41,70.23 17.65,70.99 v16.64,70.99
  Bottom 0.254: v16.64,70.99 17.91,70.99 18.8,71.88 21.97,71.88 22.48,71.37 24.26,71.37 24.77,70.87 25.27,70.87 25.65,70.48 26.42,70.48 27.43,71.5 29.46,71.5 29.97,70.99 29.97,69.34 30.73,68.58 32,68.58 33.27,69.85 DEV2.4
N$41  (via drill 0.61)
  Top 0.254: DEV3.4 42.67,45.85 37.85,45.85 37.59,46.1 37.59,73.66 36.96,74.3 30.61,74.3 29.46,73.15 29.46,70.74 v28.57,69.85 | IC6.15 19.68,70.36 v19.56,70.48
  Bottom 0.254: v19.56,70.48 19.68,70.61 21.72,70.61 21.97,70.36 23.75,70.36 24.26,69.85 24.77,69.85 25.15,69.47 26.92,69.47 27.3,69.85 v28.57,69.85
N$42  (via drill 0.61)
  Top 0.254: DEV4.4 33.66,46.86 32.64,45.85 29.21,45.85 28.96,46.1 28.96,65.79 v28.19,66.55 | IC6.11 14.61,68.71 14.86,68.45 14.86,67.69 15.49,67.06 v15.49,66.8
  Bottom 0.254: v15.49,66.8 16.51,65.66 22.61,65.66 22.86,65.41 25.65,65.41 26.92,66.67 28.07,66.67 v28.19,66.55
N$43  (via drill 0.61)
  Top 0.254: 20.95,74.8 IC6.1 20.95,75.56 21.46,76.07 23.37,76.07 v23.75,75.69 | DEV1.1 41.27,77.34 41.02,77.6 30.1,77.6 v30.1,75.69
  Bottom 0.254: v23.75,75.69 24.64,74.8 28.45,74.8 29.34,75.69 v30.1,75.69
N$44  (via drill 0.61)
  Top 0.254: 15.88,74.8 IC6.5 15.88,77.47 16,77.6 25.78,77.6 26.42,76.96 26.42,73.53 v27.05,72.9
  Bottom 0.254: v27.05,72.9 27.18,73.28 30.23,73.28 DEV2.1
N$45  (via drill 0.61)
  Top 0.254: DEV4.1 30.23,49.53 29.97,49.78 29.97,67.31 v29.21,68.07 | IC6.4 17.14,76.96 17.27,77.09 25.53,77.09 25.91,76.71 25.91,73.28 26.16,73.03 26.16,72.52 26.92,71.75 26.92,70.99 26.67,70.74 26.67,70.23 26.04,69.6 26.04,69.34 v24.77,68.07
  Bottom 0.254: v29.21,68.07 28.96,67.82 27.56,67.82 26.92,68.45 25.15,68.45 v24.77,68.07
N$46  (via drill 0.61)
  Top 0.254: DEV3.1 38.86,49.53 38.61,49.78 38.61,75.06 37.59,76.07 33.53,76.07 v33.15,75.69 | IC6.2 19.68,76.45 19.81,76.58 24.13,76.58 v25.02,75.69
  Bottom 0.254: v25.02,75.69 26.04,75.69 26.42,75.31 28.19,75.31 29.46,76.58 32.26,76.58 v33.15,75.69
N$47  (via drill 0.61)
  Top 0.254: DEV1.3 40.13,70.99 40.13,76.45 v40.39,76.71
  Bottom 0.254: IC7.12 15.88,76.96 16,77.09 26.16,77.09 26.92,76.33 27.69,76.33 28.96,77.6 40.13,77.6 40.39,77.34 v40.39,76.71
N$48
  Bottom 0.254: IC7.14 18.41,74.04 19.05,73.41 22.73,73.41 23.24,72.9 24.51,72.9 24.89,73.28 25.91,73.28 26.16,73.03 26.16,72.52 26.67,72.01 29.84,72.01 31.11,70.74 DEV2.3
N$49  (via drill 0.61)
  Top 0.254: DEV3.3 38.35,46.99 38.1,47.24 38.1,74.8 37.34,75.56 34.8,75.56 v34.42,75.18
  Bottom 0.254: IC7.15 19.68,76.45 19.81,76.58 25.91,76.58 26.67,75.82 27.94,75.82 29.21,77.09 34.16,77.09 34.42,76.83 v34.42,75.18
N$50  (via drill 0.61)
  Top 0.254: DEV4.3 29.72,46.99 29.46,47.24 29.46,66.55 28.45,67.56 27.81,67.56 26.92,66.67 26.16,66.67 25.65,67.18 25.65,67.94 26.54,68.83 26.54,69.34 27.18,69.98 27.18,70.48 27.94,71.25 27.94,73.41 27.43,73.91 26.92,73.91 26.92,76.83 v27.3,77.22
  Bottom 0.254: IC7.11 14.61,77.47 14.73,77.6 26.92,77.6 v27.3,77.22
N$51  (via drill 0.61)
  Top 0.254: DEV1.8 43.31,64.77 42.04,63.5 40.64,63.5 40.13,62.99 40.13,60.71 41.27,59.56 41.27,57.91 40.64,57.28 v39.5,57.28 | v12.57,54.23 13.34,54.99 IC8.12
  Bottom 0.254: v39.5,57.28 40.77,57.28 41.27,56.77 41.27,55.75 40.89,55.37 36.32,55.37 35.18,54.23 33.27,54.23 31.75,55.75 25.15,55.75 24.38,54.99 22.86,54.99 22.61,54.74 20.57,54.74 19.43,53.59 17.53,53.59 17.27,53.34 13.46,53.34 v12.57,54.23
N$52  (via drill 0.61)
  Top 0.254: DEV1.5 40.89,67.31 39.12,69.09 39.12,75.31 37.85,76.58 32.51,76.58 32.26,76.33 32.26,75.31 31.75,74.8 30.35,74.8 28.96,73.41 28.96,71.5 27.69,70.23 27.69,69.72 27.05,69.09 27.05,68.07 v26.54,67.56
  Bottom 0.254: v26.54,67.56 26.16,67.18 24.38,67.18 23.88,67.69 23.88,68.71 23.24,69.34 21.34,69.34 20.95,68.96 IC7.1
N$53
  Bottom 0.254: IC7.5 15.88,69.34 16.64,70.1 17.78,70.1 19.05,71.37 21.72,71.37 22.23,70.87 24,70.87 24.51,70.36 25.02,70.36 25.4,69.98 26.67,69.98 27.69,70.99 29.08,70.99 29.46,70.61 29.46,69.09 31.11,67.44 DEV2.5
N$54  (via drill 0.61)
  Top 0.254: DEV3.5 37.34,44.45 37.08,44.7 37.08,73.41 36.7,73.79 30.86,73.79 29.97,72.9 29.97,69.98 28.96,68.96 28.19,68.96 v27.94,68.71
  Bottom 0.254: IC7.2 19.68,69.34 20.45,70.1 21.46,70.1 21.72,69.85 23.5,69.85 24,69.34 24.51,69.34 24.89,68.96 27.69,68.96 v27.94,68.71
N$55  (via drill 0.61)
  Top 0.254: DEV4.5 28.7,44.45 28.45,44.7 28.45,65.02 27.3,66.17 25.4,66.17 v25.27,66.29
  Bottom 0.254: IC7.4 17.14,67.94 18.41,66.67 22.23,66.67 22.73,67.18 23.62,67.18 24.13,66.67 24.89,66.67 v25.27,66.29
N$56  (via drill 0.61)
  Top 0.254: v23.88,61.85 23.62,61.59 23.62,59.56 v22.23,58.17 | IC8.14 15.88,56.9 15.24,57.53 14.86,57.53 v13.97,58.42
  Bottom 0.254: DEV2.8 33.15,64.77 31.88,63.5 30.61,63.5 29.84,62.74 26.54,62.74 25.4,61.59 24.13,61.59 v23.88,61.85 | v13.97,58.42 14.35,58.42 14.73,58.04 19.3,58.04 20.07,57.28 21.34,57.28 v22.23,58.17
N$57  (via drill 0.61)
  Top 0.254: DEV3.8 43.43,41.91 42.16,40.64 35.81,40.64 35.56,40.89 35.56,55.24 v35.18,55.63 | v16.89,54.23 17.14,54.48 IC8.15
  Bottom 0.254: v35.18,55.63 34.29,54.74 33.53,54.74 32,56.26 24.89,56.26 24.13,55.5 22.61,55.5 22.35,55.24 20.32,55.24 19.18,54.1 17.02,54.1 v16.89,54.23
N$58  (via drill 0.61)
  Top 0.254: v12.57,52.96 11.68,53.85 11.68,54.61 12.06,54.99 IC8.11
  Bottom 0.254: DEV4.8 33.15,41.91 31.88,40.64 30.61,40.64 29.84,41.4 29.84,42.93 28.96,43.81 28.96,52.83 28.45,53.34 25.78,53.34 25.15,52.7 23.88,52.7 23.75,52.83 13.21,52.83 13.08,52.96 v12.57,52.96
N$59  (via drill 0.61)
  Top 0.254: DEV1.6 43.31,67.31 42.04,66.04 39.88,66.04 39.12,65.28 39.12,59.69 v39.5,59.31 | IC8.1 18.44,62.26 18.54,62.36 v20.57,62.36
  Bottom 0.254: v39.5,59.31 25.91,59.31 25.4,59.82 24.13,59.82 23.62,60.33 23.62,60.83 22.1,62.36 v20.57,62.36
N$60  (via drill 0.61)
  Top 0.254: IC8.5 13.34,62.23 12.95,62.61 v12.95,65.79
  Bottom 0.254: DEV2.6 33.15,67.31 31.88,66.04 30.73,66.04 29.59,64.9 22.61,64.9 22.35,65.15 16.26,65.15 15.49,65.91 13.08,65.91 v12.95,65.79
N$61  (via drill 0.61)
  Top 0.254: DEV3.6 43.43,44.45 42.16,43.18 36.83,43.18 36.58,43.43 36.58,57.53 v36.2,57.91 | IC8.2 17.14,61.09 v16.51,60.45
  Bottom 0.254: v36.2,57.91 35.81,57.53 34.54,57.53 33.78,58.29 25.4,58.29 24.89,58.8 23.62,58.8 22.61,59.82 22.61,60.33 21.97,60.96 21.21,60.96 20.19,60.07 17.78,60.07 17.4,60.45 v16.51,60.45
N$62  (via drill 0.61)
  Top 0.254: IC8.4 14.61,61.09 v15.24,60.45 | v21.59,60.07 21.59,58.8 21.34,58.55 21.34,57.78 22.61,56.52 24,56.52 24.51,56.01 v24.51,54.1
  Bottom 0.254: DEV4.6 33.27,44.45 32,45.72 30.23,45.72 29.97,45.97 29.97,53.34 28.96,54.36 24.77,54.36 v24.51,54.1 | v15.24,60.45 16.13,59.56 21.08,59.56 v21.59,60.07
N$63  (via drill 0.61)
  Top 0.254: DEV1.7 40.26,64.77 39.62,64.14 39.62,60.45 40.39,59.69 v40.39,58.29
  Bottom 0.254: v40.39,58.29 37.85,58.29 36.58,57.02 34.29,57.02 33.53,57.78 25.15,57.78 24.64,58.29 23.37,58.29 22.61,59.05 15.37,59.05 13.34,61.09 IC9.12
N$64
  Bottom 0.254: DEV2.7 30.73,64.39 23.37,64.39 22.35,63.37 21.59,63.37 20.83,64.14 16,64.14 15.88,64.01 IC9.14 15.88,62.23
N$65  (via drill 0.61)
  Top 0.254: DEV3.7 36.32,41.91 36.07,42.16 36.07,56.77 34.92,57.91 v34.92,58.42
  Bottom 0.254: v34.92,58.42 34.54,58.8 25.65,58.8 25.15,59.31 23.88,59.31 23.11,60.07 23.11,60.58 22.23,61.47 20.95,61.47 19.94,60.58 18.03,60.58 17.14,61.47 IC9.15
N$66  (via drill 0.61)
  Top 0.254: v23.24,54.1 23.24,55.88 23.11,56.01 22.35,56.01 20.45,57.91 v20.45,58.17
  Bottom 0.254: DEV4.7 31.11,42.42 29.46,44.07 29.46,53.09 28.7,53.85 25.53,53.85 24.89,53.21 24.13,53.21 v23.24,54.1 | IC9.11 12.06,61.59 15.11,58.55 20.07,58.55 v20.45,58.17
N$67  (via drill 0.61)
  Top 0.254: DEV1.9 40.64,61.59 40.64,60.96 41.78,59.82 41.78,57.66 v40.39,56.26
  Bottom 0.254: v40.39,56.26 37.34,56.26 37.08,56.52 34.04,56.52 33.27,57.28 24.38,57.28 23.62,56.52 22.1,56.52 21.84,56.26 18.41,56.26 IC9.1
N$68  (via drill 0.61)
  Top 0.254: v24.51,60.71 24.51,58.67 v23.24,57.4
  Bottom 0.254: DEV2.9 26.8,62.23 25.65,61.09 24.89,61.09 v24.51,60.71 | IC9.5 13.34,56.9 13.97,57.53 19.05,57.53 19.81,56.77 21.59,56.77 22.1,57.28 23.11,57.28 v23.24,57.4
N$69  (via drill 0.61)
  Top 0.254: DEV3.9 35.31,39.37 35.05,39.62 35.05,54.48 v33.91,55.63
  Bottom 0.254: v33.91,55.63 32.77,56.77 24.64,56.77 23.88,56.01 22.35,56.01 22.1,55.75 20.07,55.75 18.92,54.61 17.78,54.61 17.27,55.12 17.27,55.88 17.14,56.01 IC9.2
N$70  (via drill 0.61)
  Top 0.254: v13.84,54.23 14.22,53.85 v14.22,51.94
  Bottom 0.254: DEV4.9 29.34,41.15 29.34,42.67 28.45,43.56 28.45,52.58 28.19,52.83 26.04,52.83 25.4,52.2 23.62,52.2 23.5,52.32 14.61,52.32 v14.22,51.94 | IC9.4 14.61,54.99 v13.84,54.23
N$75
  Top 0.254: R21.1 41.15,24.38 42.29,24.38 EXTPW.A
N$76  (via drill 0.61)
  Top 0.254: v25.78,19.68 25.78,19.18 26.29,18.67 26.29,17.65 U1.8
  Bottom 0.254: v25.78,19.68 25.78,21.72 26.67,22.61 R19.2
N$78
  Top 0.254: R7.1 3.05,34.29 4.06,35.31 4.45,35.31 5.23,36.09 AVRPW.A
N$80
  Top 0.254: DEVPW.A 5.84,68.58 6.6,69.34 7.62,69.34 R22.2
RESET  (via drill 0.61)
  Top 0.254: RESC.3 17.14,29.72 v21.97,34.54 | U2.24 16.25,49.02 16.26,49.02 15.49,49.78 v15.11,49.78
  Bottom 0.254: v15.11,49.78 17.91,46.99 R17.1 18.03,46.99 19.56,45.47 19.56,40.39 21.21,38.73 21.21,35.31 v21.97,34.54
SCK  (via drill 0.61)
  Top 0.254: RESC.4 19.68,30.86 v23.37,34.54 | v20.95,46.1 22.1,46.1 22.35,46.35 23.37,46.35 23.34,46.38 U2.15
  Bottom 0.254: R19.1 26.67,24.38 23.75,27.3 21.59,27.3 RESC.4 | v23.37,34.54 23.37,41.15 20.95,43.56 v20.95,46.1
SSENC  (via drill 0.61)
  Top 0.254: R8.2 22.82,22.64 | 22.82,22.64 23.82,21.65 IC3.1 23.82,21.52 23.88,21.46 23.88,20.32 25.7,18.5 U1.9 | 22.82,22.64 22.82,21.68 v22.48,21.34 | v21.72,25.78 21.72,26.54 21.97,26.8 23.88,26.8 24.77,27.69 24.77,35.43 24.38,35.81 v24.38,37.47 | v21.84,44.83 22.61,45.59 23.24,45.59 23.3,45.65 U2.14
  Bottom 0.254: v22.48,21.34 22.86,21.72 22.86,24.77 21.84,25.78 v21.72,25.78 | v24.38,37.47 24.38,40.89 22.61,42.67 22.61,44.07 v21.84,44.83
SSINT  (via drill 0.61)
  Top 0.254: IC2.4 32.06,34.23 v27.94,38.35 | U2.22 17.8,48.74 17.78,48.77 v17.78,50.16
  Bottom 0.254: v27.94,38.35 26.42,38.35 25.91,38.86 25.91,41.66 24.13,43.43 24.13,48.01 24,48.13 24,49.28 23.5,49.78 18.16,49.78 v17.78,50.16
UCAP
  Top 0.254: 12.32,48.26 C18.2
  Top 0.381: U2.27 13.91,45.65 13.34,46.23 13.08,46.86 12.32,47.37 12.32,48.26
V+  (via drill 1)
  Top 0.813: 45.72,9.53 C27.+ | v43.81,7.62 45.72,9.53 | 45.72,9.53 46.35,10.16 46.35,16.51 43.81,19.05 EXT.2 40.64,20.95 R21.2 39.59,22.64 38.73,23.5 38.73,25.4 PWSEL.1 PWSEL.2
  Bottom 0.813: IC10.OUT 40.01,5.71 41.91,7.62 v43.81,7.62
VBUS
  Top 0.813: PWSEL.6 PWSEL.5
  Bottom 0.61: PWSEL.6 34.29,32.38 10.79,32.38 9.91,33.27 8.26,33.27 7.62,33.91 7.62,43.81 7.68,43.81 USB.VBUS
VCC  (via drill 0.61)
  Top 0.254: R7.2 4.66,33.44 6.35,31.75 ETHPWR.2
  Top 0.305: 14.74,41.65 U2.32 | U2.31 14.73,42.42 14.76,42.39 | 18.67,40.26 18.57,40.16 U2.4
  Top 0.381: U2.31 14.86,42.42 15.62,42.42 16.41,43.21 18,43.21 | 18,43.21 18.76,43.21 19.3,42.67 19.3,41.91 18.67,41.27 18.67,40.26 | 18,43.21 18,43.4 v17.91,43.56
  Top 0.61: 14.74,41.65 13.46,41.66 13.12,41.31 C24.1 8.89,40.01 8.26,39.37 ETHPWR.2 | U2.32 14.76,42.39
  Bottom 0.254: R17.2 16.3,46.14 15.49,45.34 15.49,43.94 16.51,42.93 C19.1
  Bottom 0.381: v17.91,43.56 17.65,43.31 16.76,43.31 C19.1
  Bottom 0.61: PWSEL.4 32.77,31.37 8.64,31.37 ETHPWR.2 8.13,31.75
VCCIO  (via drill 0.61)
  Top 0.254: 20.95,71.63 IC6.16 20.95,67.18 20.45,66.67 20.45,63.25 20.95,63.25 21.46,62.74 21.46,61.98 20.95,61.47 v19.56,61.47 18.92,60.83 17.91,60.83 17.4,60.33 17.4,59.56 | 20.95,71.63 20.95,72.01 22.23,73.28 22.23,73.91 v22.61,74.3 | 20.95,71.63 17.27,71.63 16.76,72.14 v16,72.14 | C20.1 10.16,70.87 10.41,70.61 | v11.43,70.61 10.41,70.61 | IC8.16 18.14,56.36 18.16,57.15 17.4,57.91 17.4,59.56 | 17.4,59.56 11.18,59.56 10.79,59.94 10.03,59.94 8.38,58.29 7.62,58.29 | 10.41,70.61 9.91,70.61 8.64,69.34 8.64,68.58 7.75,67.69 7.71,67.73 R22.1 | R13.1 5.71,61.59 6.48,60.83 6.48,59.44 7.62,58.29 | IC1.5 4.12,56.58 5.84,58.29 7.62,58.29 | 7.62,58.29 C21.1
  Top 0.813: DEV1.2 46.1,72.39 46.74,71.75 46.74,49.53 | 46.74,49.53 46.74,28.57 44.83,26.67 PWIO.2 41.66,26.67 39.12,29.21 PWSEL.3 | 46.74,49.53 DEV3.2
  Bottom 0.254: IC7.16 22.1,74.8 v22.61,74.3 23.5,73.41 24.26,73.41 24.64,73.79 32.26,73.79 33.66,72.52 DEV2.2 | v16,72.14 15.24,71.37 13.72,71.37 13.46,71.12 11.94,71.12 v11.43,70.61 | v19.56,61.47 19.05,61.98 18.54,61.98 IC9.16
  Bottom 0.813: DEV1.2 42.16,74.04 35.31,74.04 DEV2.2 | DEV3.2 42.16,51.18 35.31,51.18 DEV4.2

### Text on the board
Top: APB | 09 | dev2
Bottom: APB | 09